# Altium schematic sheet 03_mcu.SchDoc
size B; SheetNumber: 5; SheetTotal: 17
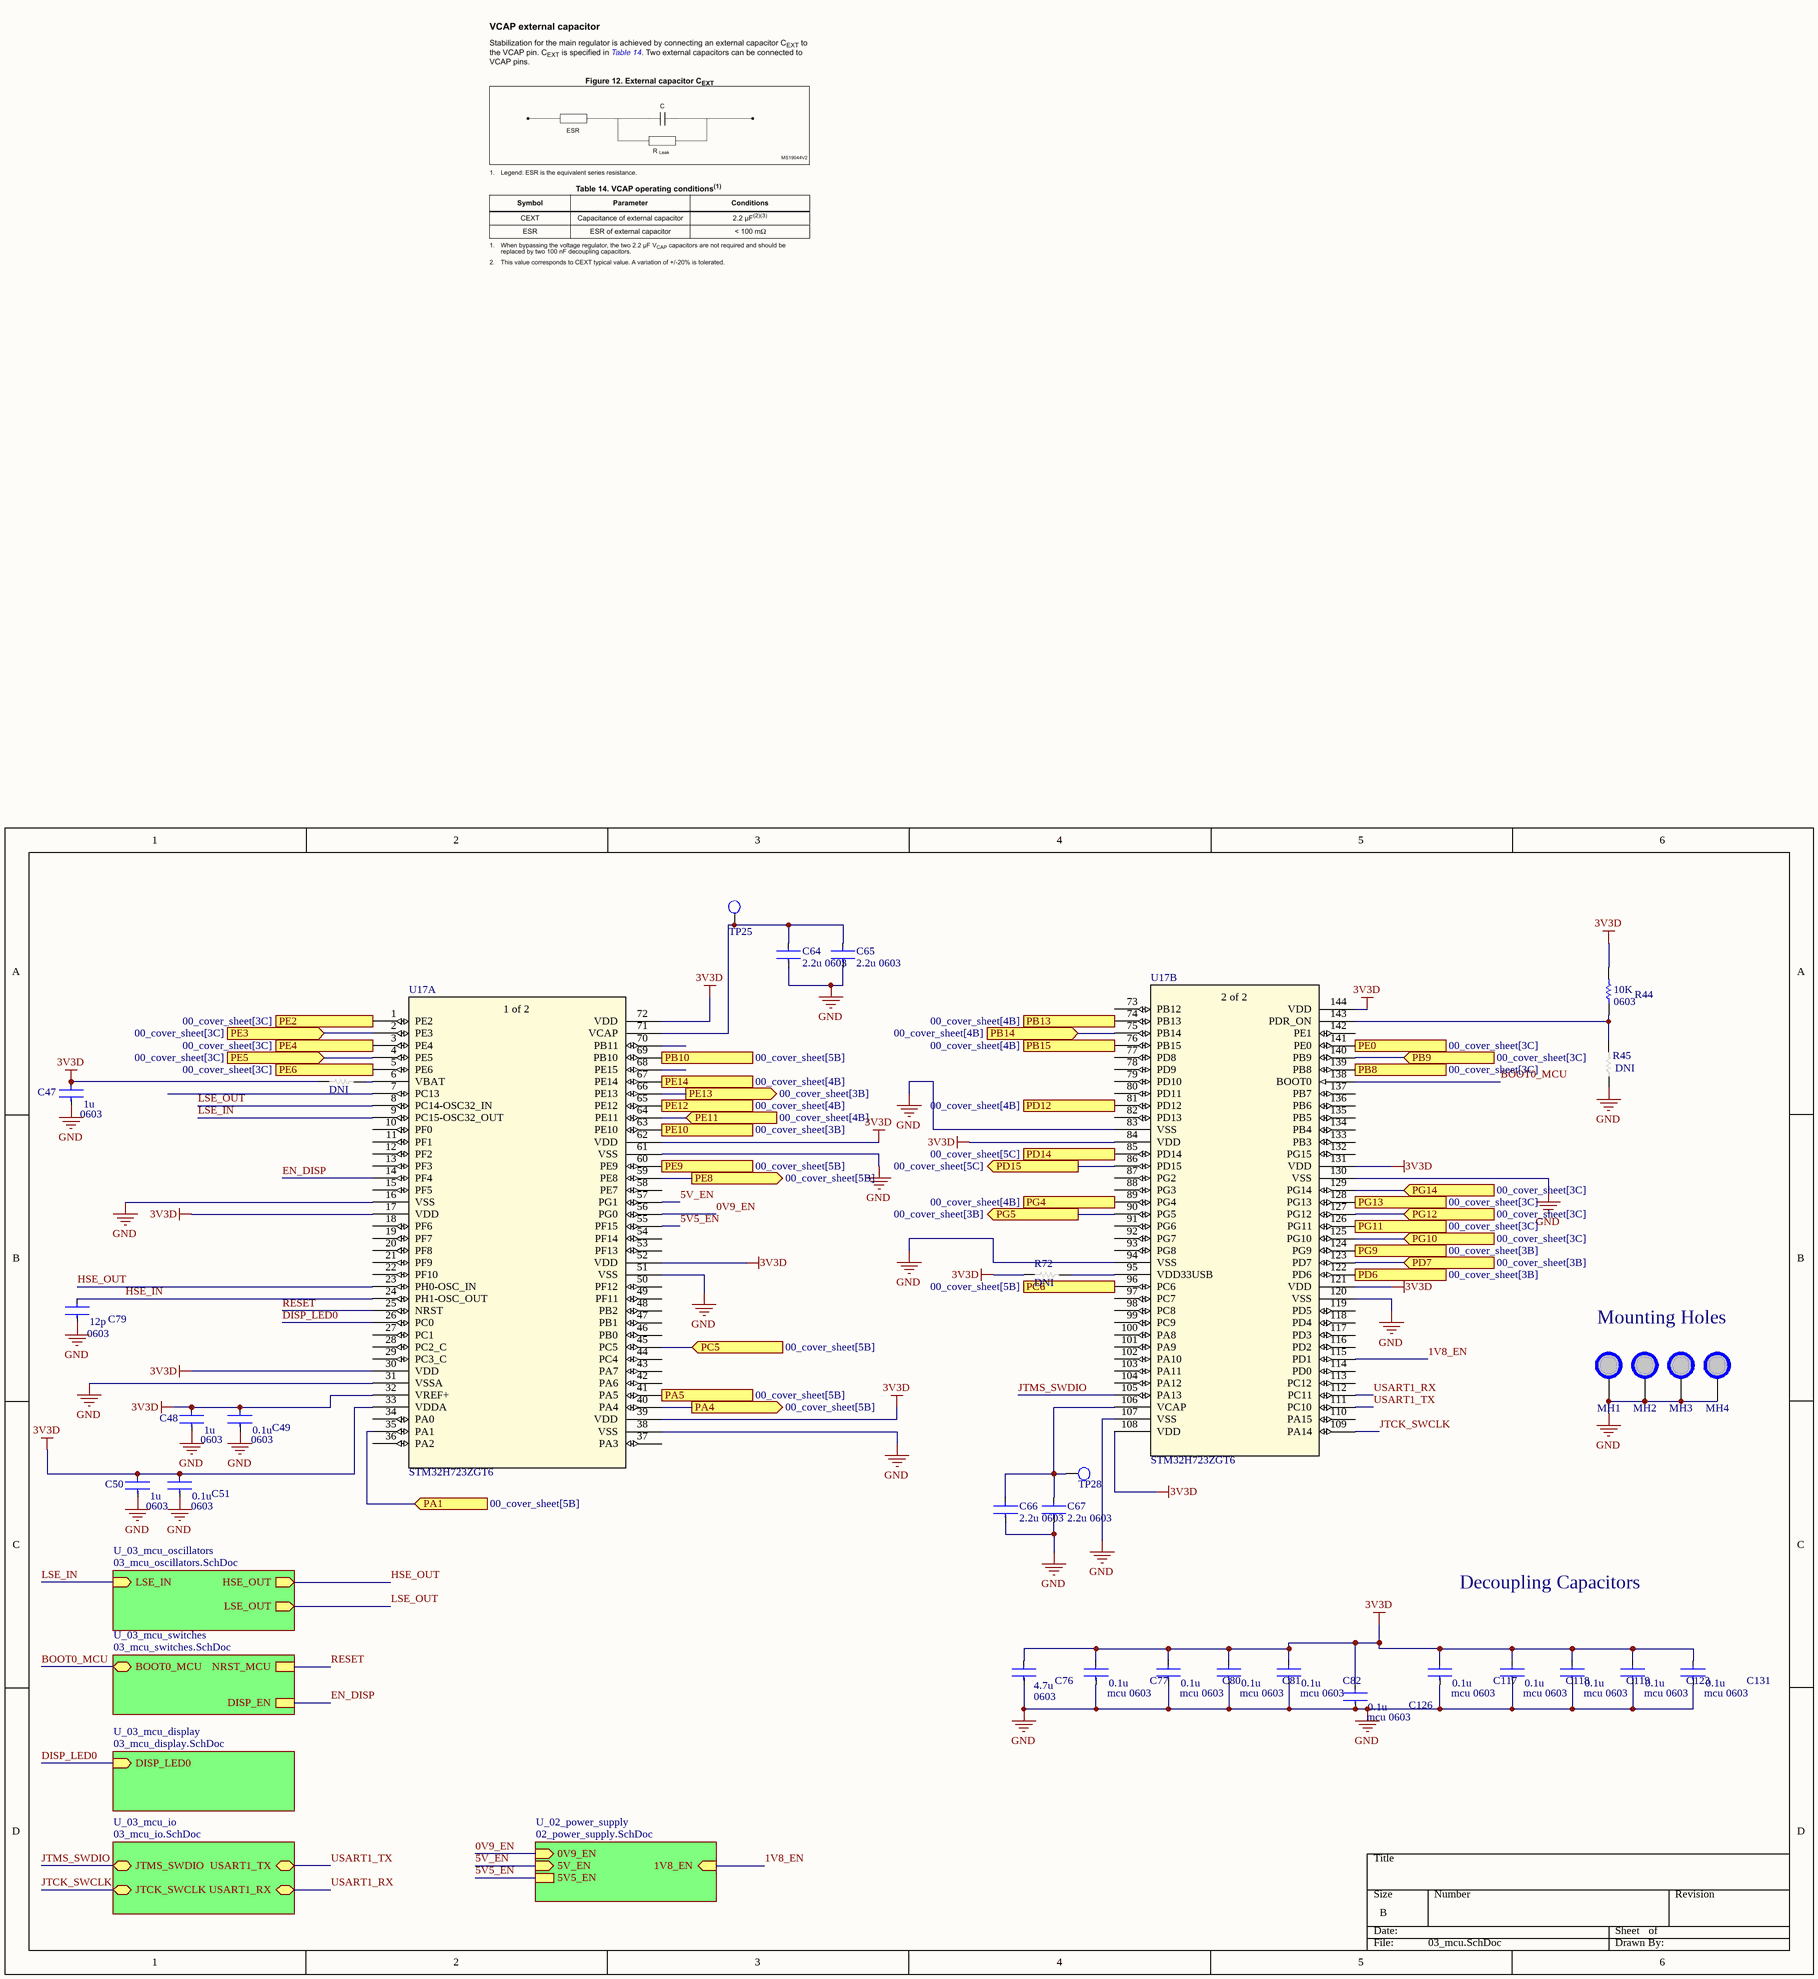
[diagram p0: 03_mcu.SchDoc]

## Parts
C47  C1608X5R1E105K080AC  [CAPTDK0603]  (value not drawn)
C48  C1608X5R1E105K080AC  [CAPTDK0603]  (value not drawn)
C49  CGA3E2X7R1H104K080AA  [CAPTDK0603]  (value not drawn)
C50  C1608X5R1E105K080AC  [CAPTDK0603]  (value not drawn)
C51  CGA3E2X7R1H104K080AA  [CAPTDK0603]  (value not drawn)
C64  2.2u 0603  [CAPTDK0603]
C65  2.2u 0603  [CAPTDK0603]
C66  2.2u 0603  [CAPTDK0603]
C67  2.2u 0603  [CAPTDK0603]
C76  C1608X5R1E475K080AC  [CAPTDK0603]  (value not drawn)
C77  NMC0603X7R104K50TRPF  [CAPTDK0603]  (value not drawn)
C79  CGA3E2C0G1H120J080AA  [CAPTDK0603]  (value not drawn)
C80  NMC0603X7R104K50TRPF  [CAPTDK0603]  (value not drawn)
C81  NMC0603X7R104K50TRPF  [CAPTDK0603]  (value not drawn)
C82  NMC0603X7R104K50TRPF  [CAPTDK0603]  (value not drawn)
C117  NMC0603X7R104K50TRPF  [CAPTDK0603]  (value not drawn)
C118  NMC0603X7R104K50TRPF  [CAPTDK0603]  (value not drawn)
C119  NMC0603X7R104K50TRPF  [CAPTDK0603]  (value not drawn)
C123  NMC0603X7R104K50TRPF  [CAPTDK0603]  (value not drawn)
C126  NMC0603X7R104K50TRPF  [CAPTDK0603]  (value not drawn)
C131  NMC0603X7R104K50TRPF  [CAPTDK0603]  (value not drawn)
MH1  M3.5 Mounting Hole  [M3.5 Mounting Hole - Supported]  (value not drawn)  (no BOM)
MH2  M3.5 Mounting Hole  [M3.5 Mounting Hole - Supported]  (value not drawn)  (no BOM)
MH3  M3.5 Mounting Hole  [M3.5 Mounting Hole - Supported]  (value not drawn)  (no BOM)
MH4  M3.5 Mounting Hole  [M3.5 Mounting Hole - Supported]  (value not drawn)  (no BOM)
R44  RMCF0603JG10K0  [RES-STACK-POLE-0603]  (value not drawn)
R45  DNI  [RES_0603]
R46  DNI  [RES_0603]
R72  DNI  [RES_0603]
TP25  TESTPOINT_S  [TESTPOINT_S]  (value not drawn)  (no BOM)
TP28  TESTPOINT_S  [TESTPOINT_S]  (value not drawn)  (no BOM)
U17  STM32H723ZGT6  [LQFP144]  (parts A,B of 2)

## Sub-sheets
U_02_power_supply = 02_power_supply.SchDoc: 1V8_EN (in), 0V9_EN (in), 5V_EN (in), 5V5_EN
U_03_mcu_display = 03_mcu_display.SchDoc: DISP_LED0 (in)
U_03_mcu_io = 03_mcu_io.SchDoc: USART1_TX (bidir), USART1_RX (bidir), JTMS_SWDIO (bidir), JTCK_SWCLK (bidir)
U_03_mcu_oscillators = 03_mcu_oscillators.SchDoc: HSE_OUT (out), LSE_IN (in), LSE_OUT (out)
U_03_mcu_switches = 03_mcu_switches.SchDoc: BOOT0_MCU (bidir), NRST_MCU, DISP_EN

## Ports
PA1 (in, see 00_cover_sheet[5B]), PA4 (out, see 00_cover_sheet[5B]), PA5 (out, see 00_cover_sheet[5B]), PB8 (in, see 00_cover_sheet[3C]), PB9 (in, see 00_cover_sheet[3C]), PB10 (out, see 00_cover_sheet[5B]), PB13 (out, see 00_cover_sheet[4B]), PB14 (in, see 00_cover_sheet[4B]), PB15 (out, see 00_cover_sheet[4B]), PC5 (in, see 00_cover_sheet[5B]), PC6 (out, see 00_cover_sheet[5B]), PD6 (in, see 00_cover_sheet[3B]), PD7 (in, see 00_cover_sheet[3B]), PD12 (out, see 00_cover_sheet[4B]), PD14 (in, see 00_cover_sheet[5C]), PD15 (out, see 00_cover_sheet[5C]), PE0 (in, see 00_cover_sheet[3C]), PE2 (in, see 00_cover_sheet[3C]), PE3 (in, see 00_cover_sheet[3C]), PE4 (in, see 00_cover_sheet[3C]), PE5 (in, see 00_cover_sheet[3C]), PE6 (in, see 00_cover_sheet[3C]), PE8 (out, see 00_cover_sheet[5B]), PE9 (out, see 00_cover_sheet[5B]), PE10 (out, see 00_cover_sheet[3B]), PE11 (in, see 00_cover_sheet[4B]), PE12 (in, see 00_cover_sheet[4B]), PE13 (out, see 00_cover_sheet[3B]), PE14 (in, see 00_cover_sheet[4B]), PG4 (in, see 00_cover_sheet[4B]), PG5 (out, see 00_cover_sheet[3B]), PG9 (in, see 00_cover_sheet[3B]), PG10 (in, see 00_cover_sheet[3C]), PG11 (in, see 00_cover_sheet[3C]), PG12 (in, see 00_cover_sheet[3C]), PG13 (in, see 00_cover_sheet[3C]), PG14 (in, see 00_cover_sheet[3C])

## Nets
3V3D: C47.1 C48.1 C49.1 C50.1 C51.1 C76.1 C77.1 C80.1 C81.1 C82.1 C117.1 C118.1 C119.1 C123.1 C126.1 C131.1 R44.2 R46.1 R72.1 U17.17(VDD) U17.30(VDD) U17.32(VREF+) U17.33(VDDA) U17.39(VDD) U17.52(VDD) U17.62(VDD) U17.72(VDD) U17.84(VDD) U17.108(VDD) U17.121(VDD) U17.131(VDD) U17.144(VDD)
GND: C47.2 C48.2 C49.2 C50.2 C51.2 C64.2 C65.2 C66.2 C67.2 C76.2 C77.2 C79.2 C80.2 C81.2 C82.2 C117.2 C118.2 C119.2 C123.2 C126.2 C131.2 MH1.1 MH2.1 MH3.1 MH4.1 R45.1 U17.16(VSS) U17.31(VSSA) U17.38(VSS) U17.51(VSS) U17.61(VSS) U17.83(VSS) U17.94(VSS) U17.107(VSS) U17.120(VSS) U17.130(VSS)
0V9_EN: U17.56(PG0) ; sheet U_02_power_supply/0V9_EN
1V8_EN: U17.115(PD1) ; sheet U_02_power_supply/1V8_EN
5V5_EN: U17.55(PF15) ; sheet U_02_power_supply/5V5_EN
5V_EN: U17.57(PG1) ; sheet U_02_power_supply/5V_EN
BOOT0_MCU: U17.138(BOOT0) ; sheet U_03_mcu_switches/BOOT0_MCU
DISP_LED0: U17.26(PC0) ; sheet U_03_mcu_display/DISP_LED0
EN_DISP: U17.14(PF4) ; sheet U_03_mcu_switches/DISP_EN
HSE_IN: C79.1 U17.24(PH1-OSC_OUT)
HSE_OUT: U17.23(PH0-OSC_IN) ; sheet U_03_mcu_oscillators/HSE_OUT
JTCK_SWCLK: U17.109(PA14) ; sheet U_03_mcu_io/JTCK_SWCLK
JTMS_SWDIO: U17.105(PA13) ; sheet U_03_mcu_io/JTMS_SWDIO
LSE_IN: U17.9(PC15-OSC32_OUT) ; sheet U_03_mcu_oscillators/LSE_IN
LSE_OUT: U17.8(PC14-OSC32_IN) ; sheet U_03_mcu_oscillators/LSE_OUT
PA1: U17.35(PA1) ; port PA1
PA4: U17.40(PA4) ; port PA4
PA5: U17.41(PA5) ; port PA5
PB8: U17.139(PB8) ; port PB8
PB9: U17.140(PB9) ; port PB9
PB10: U17.69(PB10) ; port PB10
PB13: U17.74(PB13) ; port PB13
PB14: U17.75(PB14) ; port PB14
PB15: U17.76(PB15) ; port PB15
PC5: U17.45(PC5) ; port PC5
PC6: U17.96(PC6) ; port PC6
PD6: U17.122(PD6) ; port PD6
PD7: U17.123(PD7) ; port PD7
PD12: U17.81(PD12) ; port PD12
PD14: U17.85(PD14) ; port PD14
PD15: U17.86(PD15) ; port PD15
PE0: U17.141(PE0) ; port PE0
PE2: U17.1(PE2) ; port PE2
PE3: U17.2(PE3) ; port PE3
PE4: U17.3(PE4) ; port PE4
PE5: U17.4(PE5) ; port PE5
PE6: U17.5(PE6) ; port PE6
PE8: U17.59(PE8) ; port PE8
PE9: U17.60(PE9) ; port PE9
PE10: U17.63(PE10) ; port PE10
PE11: U17.64(PE11) ; port PE11
PE12: U17.65(PE12) ; port PE12
PE13: U17.66(PE13) ; port PE13
PE14: U17.67(PE14) ; port PE14
PG4: U17.89(PG4) ; port PG4
PG5: U17.90(PG5) ; port PG5
PG9: U17.124(PG9) ; port PG9
PG10: U17.125(PG10) ; port PG10
PG11: U17.126(PG11) ; port PG11
PG12: U17.127(PG12) ; port PG12
PG13: U17.128(PG13) ; port PG13
PG14: U17.129(PG14) ; port PG14
RESET: U17.25(NRST) ; sheet U_03_mcu_switches/NRST_MCU
USART1_RX: U17.112(PC11) ; sheet U_03_mcu_io/USART1_RX
USART1_TX: U17.111(PC10) ; sheet U_03_mcu_io/USART1_TX
NetC64_1: C64.1 C65.1 TP25.1 U17.71(VCAP)
NetC66_1: C66.1 C67.1 TP28.1 U17.106(VCAP)
NetR44_1: R44.1 R45.2 U17.143(PDR_ON)
NetR46_2: R46.2 U17.6(VBAT)
NetR72_2: R72.2 U17.95(VDD33USB)

Not connected (* = marked no-connect by the designer): U17 7(PC13) 10(PF0) 11(PF1) 12(PF2) 13(PF3) 15(PF5) 18(PF6) 19(PF7) 20(PF8) 21(PF9) 22(PF10) 27(PC1) 28(PC2_C) 29(PC3_C) 34(PA0) 36(PA2) 37(PA3) 42(PA6) 43(PA7) 44(PC4) 46(PB0) 47(PB1) 48(PB2) 49(PF11) 50(PF12) 53(PF13) 54(PF14) 58(PE7) 68(PE15) 70(PB11) 73(PB12) 77(PD8) 78(PD9) 79(PD10) 80(PD11) 82(PD13) 87(PG2) 88(PG3) 91(PG6) 92(PG7) 93(PG8) 97(PC7) 98(PC8) 99(PC9) 100(PA8) 101(PA9) 102(PA10) 103(PA11) 104(PA12) 110(PA15) 113(PC12) 114(PD0) 116(PD2) 117(PD3) 118(PD4) 119(PD5) 132(PG15) 133(PB3) 134(PB4) 135(PB5) 136(PB6) 137(PB7) 142(PE1)

## Notes on the sheet
- Mounting Holes
- Decoupling Capacitors
- (in symbol C1608X5R1E105K080AC) 1u; 0603
- (in symbol C1608X5R1E475K080AC) 4.7u; 0603
- (in symbol CGA3E2C0G1H120J080AA) 12p; 0603
- (in symbol CGA3E2X7R1H104K080AA) 0.1u; 0603
- (in symbol NMC0603X7R104K50TRPF) 0.1u; mcu 0603
- (in symbol RMCF0603JG10K0) 10K; 0603
- (in symbol STM32H723ZGT6, part A) 1 of 2
- (in symbol STM32H723ZGT6, part B) 2 of 2

## Library data of the parts
C47 C48 C50 = C1608X5R1E105K080AC: CAP CER 1UF 25V X5R 0603; Supplier 1: Digi-Key; Supplier Part Number 1: 445-5146-1-ND
C49 C51 = CGA3E2X7R1H104K080AA: CAP CER 0.1UF 50V X7R 0603; Supplier 1: Digi-Key; Supplier Part Number 1: 445-5666-1-ND
C64-C67 = C1608X5R1E225K080AB: CAP CER 2.2UF 25V X5R 0603; Supplier 1: Digikey; Supplier Part Number 1: 445-5964-1-ND
C76 = C1608X5R1E475K080AC: CAP CER 4.7UF 25V X5R 0603; Supplier 1: Digi-Key; Supplier Part Number 1: 445-9050-1-ND
C77 C80-C82 C117-C119 C123 C126 C131 = NMC0603X7R104K50TRPF: 0.1 µF ±10% 50V Ceramic Capacitor X7R 0603 (1608 Metric) low esr mcu caps; Supplier 1: Digikey; Supplier Part Number 1: 4988-NMC0603X7R104K50TRPFCT-ND
C79 = CGA3E2C0G1H120J080AA: CAP CER 12PF 50V C0G 0603; Supplier 1: Digi-Key; Supplier Part Number 1: 445-5629-1-ND
R44 = RMCF0603JG10K0: RES 10K OHM 5% 1/10W 0603; Supplier 1: Digi-Key; Supplier Part Number 1: 738-RMCF0603JG10K0CT-ND
R45 R46 R72 = R0603: RES DNI 0603
TP25 TP28 = TESTPOINT_S: Testpoint Surface Pad
U17 = STM32H723ZGT6: No Description Available; Mfr_Name: STMicroelectronics; Copyright: Copyright (C) 2024 Ultra Librarian. All rights reserved.; Manufacturer_Part_Number: STM32H723ZGT6; RefDes: RefDes; Type: DEV; Supplier 1: Digikey; Supplier Part Number 1: 497-STM32H723ZGT6-ND
MH1-MH4 = M3.5 Mounting Hole: Published: 8-Jun-2000; LatestRevisionDate: 17-Jul-2002; LatestRevisionNote: Re-released for DXP Platform.; PackageReference: RAD-0.3; Publisher: Altium Limited; PackageDescription: Radial Cap, Thru-Hole; 2 Leads; 0.3 in Pin Spacing